# Altium schematic sheet Power Supply.SchDoc
size A4
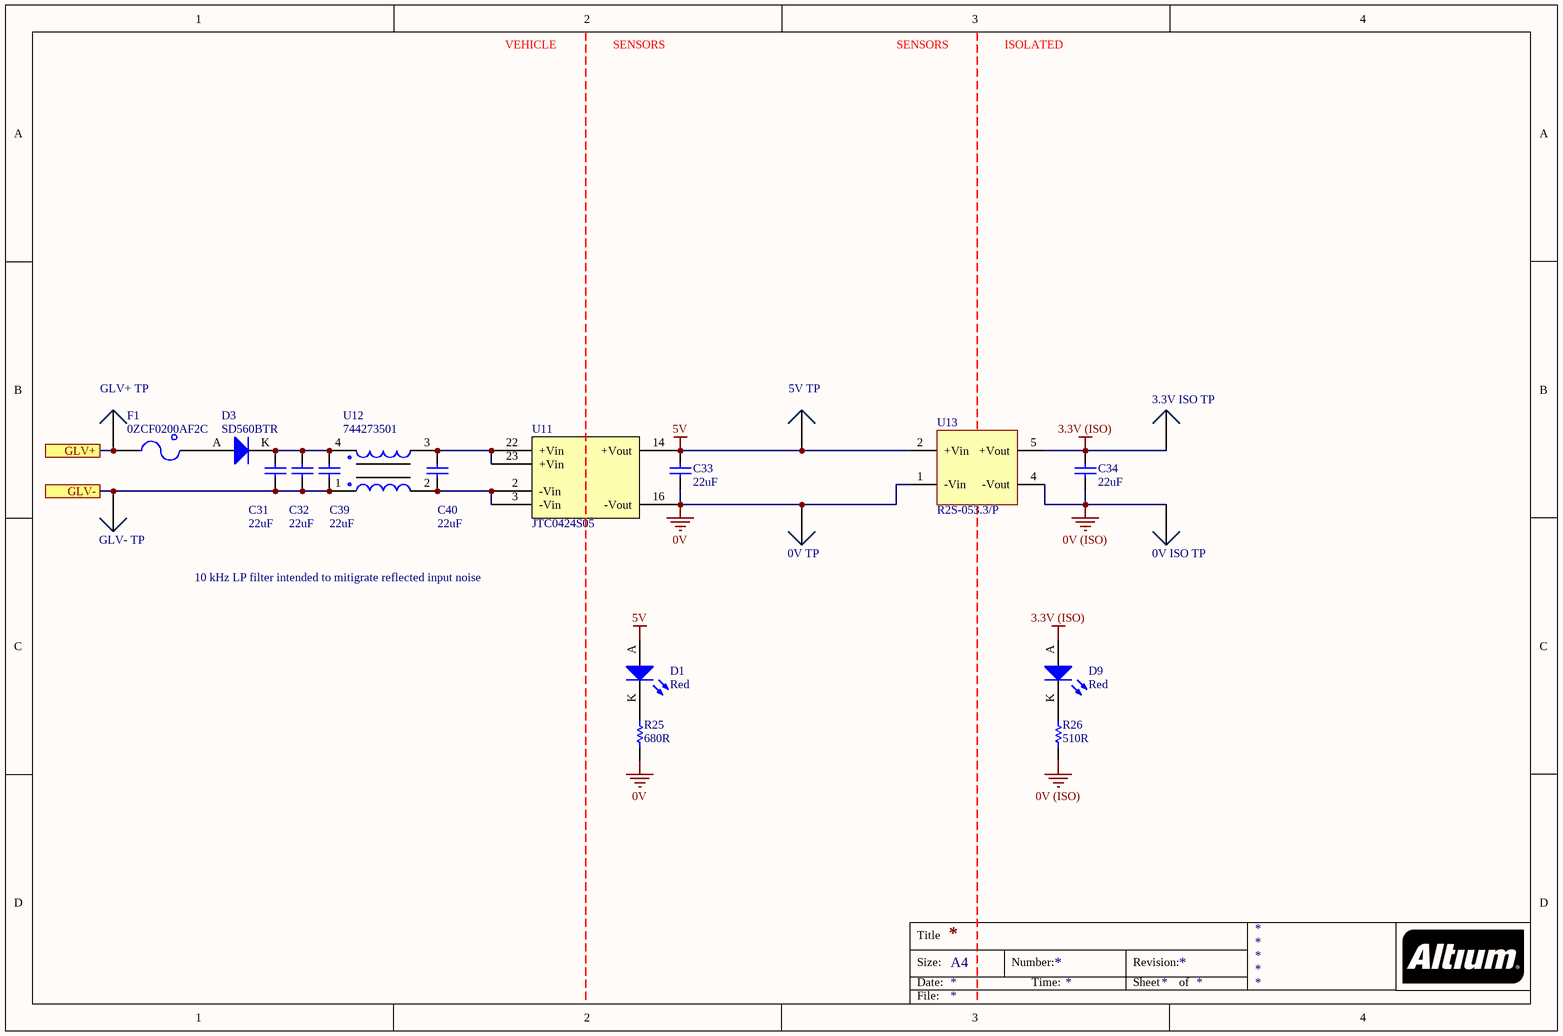
[diagram p0: Power Supply.SchDoc]

## Parts
0V_ISO_TP  0mm  [SMD Test Point]  (value not drawn)
0V_TP  0mm  [SMD Test Point]  (value not drawn)
3.3V_ISO_TP  0mm  [SMD Test Point]  (value not drawn)
5V_TP  0mm  [SMD Test Point]  (value not drawn)
C31  22uF  [1206]
C32  22uF  [1206]
C33  22uF  [1206]
C34  22uF  [1206]
C39  22uF  [1206]
C40  22uF  [1206]
D1  Red  [0805 LED]
D3  SD560BTR  [SMB Diode]
D9  Red  [0805 LED]
F1  0ZCF0200AF2C  [2920]
GLV+_TP  0mm  [SMD Test Point]  (value not drawn)
GLV-_TP  0mm  [SMD Test Point]  (value not drawn)
R25  680R  [0805]
R26  510R  [0805]
U11  JTC0424S05  [24-DIP Module, 7 Leads]
U12  744273501  [Wurth 4-PC Pad]
U13  R2S-053.3/P  [RECOM 8-SMD (5 Pin)]

## Ports
GLV+, GLV-

## Nets
0V: 0V_TP.1 C33.1 R25.1 U11.16(-Vout) U13.1(-Vin)
0V (ISO): 0V_ISO_TP.1 C34.1 R26.1 U13.4(-Vout)
3.3V (ISO): 3.3V_ISO_TP.1 C34.2 D9.A U13.5(+Vout)
5V: 5V_TP.1 C33.2 D1.A U11.14(+Vout) U13.2(+Vin)
GLV+: F1.1 GLV+_TP.1 ; port GLV+
GLV-: C31.1 C32.1 C39.1 GLV-_TP.1 U12.1 ; port GLV-
NetC31_2: C31.2 C32.2 C39.2 D3.K U12.4
NetC40_1: C40.1 U11.2(-Vin) U11.3(-Vin) U12.2
NetC40_2: C40.2 U11.22(+Vin) U11.23(+Vin) U12.3
NetD1_K: D1.K R25.2
NetD3_A: D3.A F1.2
NetD9_K: D9.K R26.2

## Notes on the sheet
- VEHICLE
- SENSORS
- ISOLATED
- 10 kHz LP filter intended to mitigrate reflected input noise
- Title
- Size:
- Date:
- A4
- Number:
- Time:
- Revision:
- Sheet
- of
- File:

## Library data of the parts
0V_ISO_TP 0V_TP 3.3V_ISO_TP 5V_TP GLV+_TP GLV-_TP = SMD Test Point: Positions: 1; Row Spacing: 0; Flange: No; Contact: NA; Part Number: SMD Test Point; Pitch: 0mm; Angle: 0
C31-C34 C39 C40 = CC1206MKX5R7BB226: Manufacturer: YAGEO; Tolerance: 20%; Material: Ceramic; Rated Voltage: 16V; Part Number: CC1206MKX5R7BB226; Value: 22uF; Digikey Part Number: 311-1997-2-ND
D1 D9 = SML-210LTT86: Red LED Indication - Discrete 1.75V 0805 (2012 Metric); Manufacturer: ROHM Semiconductor; Part Number: SML-210LTT86; Colour: Red; Digikey Part Number: 511-1286-1-ND; Digikey Link: https://www.digikey.com/product-detail/en/rohm-semiconductor/SML-210LTT86/511-1286-1-ND/637099
D3 = SD560BTR: 1.2V_F 600V 5A SMB; Manufacturer: SMC Diode Solutions; Part Number: SD560BTR; Digikey Part Number: 1655-1530-2-ND; Digikey Link: https://www.digikey.com/product-detail/en/smc-diode-solutions/SD560BTR/1655-1530-2-ND/6022620
F1 = 0ZCF0200AF2C: SMD 24V 2A Fuse; Manufacturer: Bel Fuse Inc; Part Number: 0ZCF0200AF2C; Digikey Part Number: 507-1749-2-ND; Digikey Link: https://www.digikey.com/product-detail/en/bel-fuse-inc/0ZCF0200AF2C/507-1749-2-ND/4156090
R25 = RC0805FR07680RL: Manufacturer: YAGEO; Tolerance: 0.01; Rated Voltage: 0.125W; Part Number: RC0805FR07680RL; Value: 680R; Material: FR-07
R26 = RC0805FR07510RL: Manufacturer: YAGEO; Tolerance: 0.01; Rated Voltage: 0.125W; Part Number: RC0805FR07510RL; Value: 510R; Material: FR-07
U11 = JTC0424S05: DC DC CONVERTER 5V 4W; Manufacturer: XP Power; Input Voltage: 9V-36V; Efficiency: 0.79; Isolation: Isolated; Part Number: JTC0424S05; Output Voltage: 5V; Output Power: 4W; Digikey Part Number: JTC0424S05-ND; Digikey Link: https://www.digikey.com/products/en?keywords=%20JTC0424S05
U12 = 744273501: 5µH @ 100kHz 2 Line Common Mode Choke Surface Mount 500 Ohms @ 130MHz 5A DCR 5.5mOhm; Manufacturer: Wurth Electronics Inc; Part Number: 744273501; Inductance: 5µH @ 100kHz; Impedence: 500 Ohms @ 130MHz; Material: Wirewound; Rated Current: 5A; Digikey Part Number: 732-2214-6-ND; Digikey Link: https://www.digikey.com/product-detail/en/w-rth-elektronik/744273501/732-2214-6-ND/2175826
U13 = R2S-053.3/P: Isolated Module DC DC Converter 1 Output 3.3V 606mA 4.5V - 5.5V Input; Manufacturer: Recom; Output Power: 2W; Efficiency: 0.75; Part Number: R2S-053.3/P; Input Voltage: 4.5V-5.5V; Output Voltage: 3.3V; Isolation: Isolated; Digikey Part Number: 945-2677-5-ND; Digikey Link: https://www.digikey.com/product-detail/en/recom-power/R2S-053.3-P/945-2677-5-ND/2302804